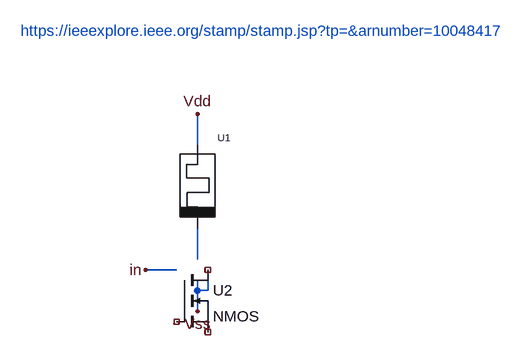
[diagram p0: schematic 1M1T.asc]
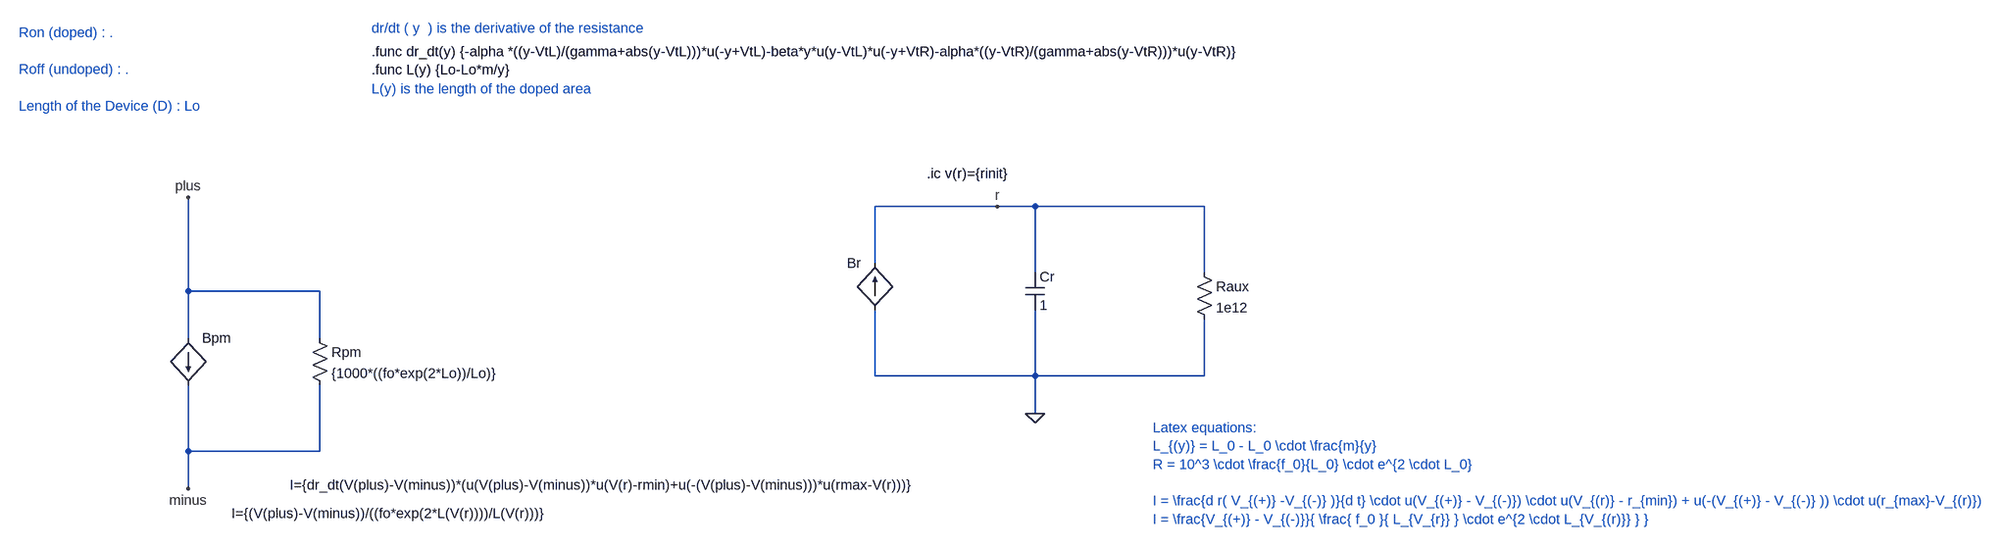
[diagram p1: sub-circuit memristor.asc]
1M1T.asc, the LTspice schematic file:
Version 4
SHEET 1 2596 908
WIRE 912 -144 912 -192
WIRE 912 32 912 -16
WIRE 880 48 832 48
WIRE 912 80 912 64
WIRE 928 80 928 64
WIRE 928 80 912 80
WIRE 912 112 912 80
FLAG 832 48 in
FLAG 912 112 Vss
FLAG 912 -192 Vdd
SYMBOL nmos 880 48 R0
SYMATTR InstName U2
SYMBOL memristor 912 -80 R0
SYMATTR InstName U1
TEXT 640 -320 Left 2 ;https://ieeexplore.ieee.org/stamp/stamp.jsp?tp=&arnumber=10048417

memristor.asc, the sub-circuit schematic file:
Version 4
SHEET 1 3888 680
WIRE 1872 32 1664 32
WIRE 1936 32 1872 32
WIRE 2224 32 1936 32
WIRE 1664 128 1664 32
WIRE 1936 144 1936 32
WIRE 2224 144 2224 32
WIRE 496 176 496 16
WIRE 720 176 496 176
WIRE 496 256 496 176
WIRE 720 256 720 176
WIRE 1664 320 1664 208
WIRE 1936 320 1936 208
WIRE 1936 320 1664 320
WIRE 2224 320 2224 224
WIRE 2224 320 1936 320
WIRE 1936 384 1936 320
WIRE 496 448 496 336
WIRE 720 448 720 336
WIRE 720 448 496 448
WIRE 496 512 496 448
FLAG 496 16 plus
FLAG 496 512 minus
FLAG 1936 384 0
FLAG 1872 32 r
SYMBOL bi 496 256 R0
WINDOW 3 74 298 Left 2
SYMATTR Value I={(V(plus)-V(minus))/((fo*exp(2*L(V(r))))/L(V(r)))}
SYMATTR InstName Bpm
SYMBOL res 704 240 R0
SYMATTR InstName Rpm
SYMATTR Value {1000*((fo*exp(2*Lo))/Lo)}
SYMBOL cap 1920 144 R0
SYMATTR InstName Cr
SYMATTR Value 1
SYMBOL res 2208 128 R0
SYMATTR InstName Raux
SYMATTR Value 1e12
SYMBOL bi 1664 208 R180
WINDOW 0 24 80 Left 2
WINDOW 3 -60 -298 Left 2
SYMATTR InstName Br
SYMATTR Value I={dr_dt(V(plus)-V(minus))*(u(V(plus)-V(minus))*u(V(r)-rmin)+u(-(V(plus)-V(minus)))*u(rmax-V(r)))}
TEXT 1752 -24 Left 2 !.ic v(r)={rinit}
TEXT 808 -232 Left 2 !.func dr_dt(y) {-alpha *((y-VtL)/(gamma+abs(y-VtL)))*u(-y+VtL)-beta*y*u(y-VtL)*u(-y+VtR)-alpha*((y-VtR)/(gamma+abs(y-VtR)))*u(y-VtR)}\n.func L(y) {Lo-Lo*m/y}
TEXT 808 -168 Left 2 ;L(y) is the length of the doped area
TEXT 808 -272 Left 2 ;dr/dt ( y  ) is the derivative of the resistance
TEXT 208 -264 Left 2 ;Ron (doped) : .\n \nRoff (undoped) : .\n \nLength of the Device (D) : Lo
TEXT 2136 408 Left 2 ;Latex equations:\nL_{(y)} = L_0 - L_0 \\cdot \\frac{m}{y}\nR = 10^3 \\cdot \\frac{f_0}{L_0} \\cdot e^{2 \\cdot L_0}\n \nI = \\frac{d r( V_{(+)} -V_{(-)} )}{d t} \\cdot u(V_{(+)} - V_{(-)}) \\cdot u(V_{(r)} - r_{min}) + u(-(V_{(+)} - V_{(-)} )) \\cdot u(r_{max}-V_{(r)})\nI = \\frac{V_{(+)} - V_{(-)}}{ \\frac{ f_0 }{ L_{V_{r}} } \\cdot e^{2 \\cdot L_{V_{(r)}} } }

The netlist it stands for:
* 1M1T.asc
* U2: NMOS (symbol nmos not certain, pin order unknown); nets seen at it: 
XU1 Vdd N001 memristor params: rmin=100 rmax=390 rinit=100 alpha=1E9 beta=0 gamma=0.1 VtR=1.5 VtL=-1.5 yo=0.0001 m=82 fo=310 Lo=5

* block symbol definitions
.subckt memristor plus minus
Bpm plus minus I={(V(plus)-V(minus))/((fo*exp(2*L(V(r))))/L(V(r)))}
Rpm plus minus {1000*((fo*exp(2*Lo))/Lo)}
Cr r 0 1
Raux r 0 1e12
Br 0 r I={dr_dt(V(plus)-V(minus))*(u(V(plus)-V(minus))*u(V(r)-rmin)+u(-(V(plus)-V(minus)))*u(rmax-V(r)))}
.ic v(r)={rinit}
.func dr_dt(y) {-alpha *((y-VtL)/(gamma+abs(y-VtL)))*u(-y+VtL)-beta*y*u(y-VtL)*u(-y+VtR)-alpha*((y-VtR)/(gamma+abs(y-VtR)))*u(y-VtR)}
.func L(y) {Lo-Lo*m/y}
* L(y) is the length of the doped area
* dr/dt ( y  ) is the derivative of the resistance
* Ron (doped) : .
* Roff (undoped) : .
* Length of the Device (D) : Lo
* Latex equations:
* L_{(y)} = L_0 - L_0 \cdot \frac{m}{y}
* R = 10^3 \cdot \frac{f_0}{L_0} \cdot e^{2 \cdot L_0}
* I = \frac{d r( V_{(+)} -V_{(-)} )}{d t} \cdot u(V_{(+)} - V_{(-)}) \cdot u(V_{(r)} - r_{min}) + u(-(V_{(+)} - V_{(-)} )) \cdot u(r_{max}-V_{(r)})
* I = \frac{V_{(+)} - V_{(-)}}{ \frac{ f_0 }{ L_{V_{r}} } \cdot e^{2 \cdot L_{V_{(r)}} } }
.ends memristor

* https://ieeexplore.ieee.org/stamp/stamp.jsp?tp=&arnumber=10048417
.backanno
.end